# EAGLE design Uno_Shield (EAGLE 8.3.2)
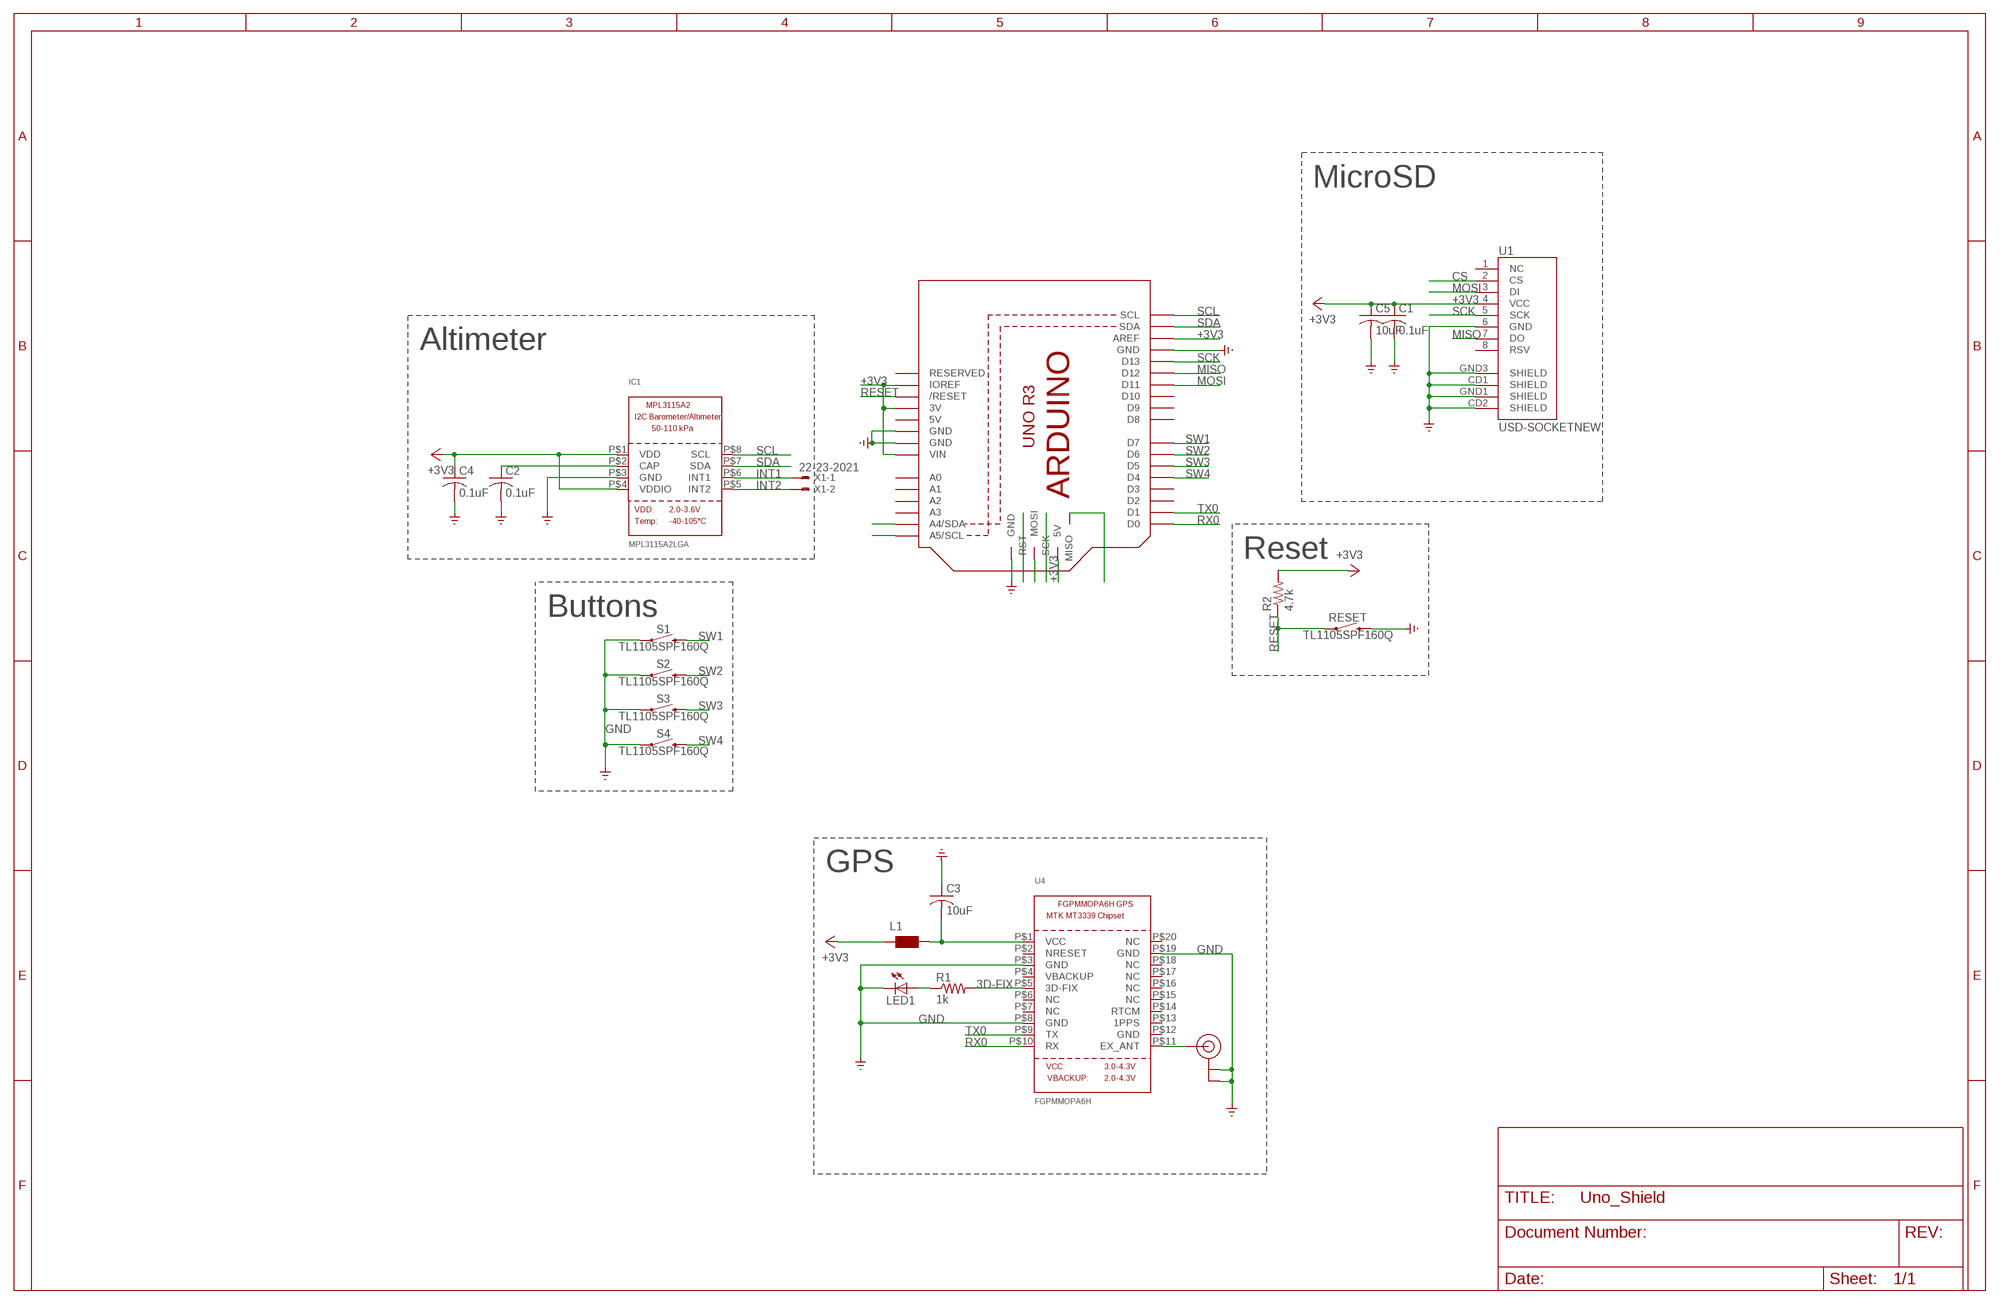
[diagram p0: schematic, sheet 1]

## Parts
C1  0.1uF  C-USC1206  [C1206]
C2  0.1uF  C-USC1206  [C1206]
C3  10uF  C-USC1206  [C1206]
C4  0.1uF  C-USC1206  [C1206]
C5  10uF  C-USC1206  [C1206]
IC1  MPL3115A2LGA  [LGA8]
L1  WE-CBF_1206  [1206]
LED1  LEDSMT1206  [1206]
M1  ARDUINO_R3_ICSP  [ARDUINOR3_ICSP]
R1  1k  R-US_R1206  [R1206]
R2  4.7k  R-US_R1206  [R1206]
RESET  TL1105SPF160Q  MOMENTARY-SWITCH-SPST-PTH-6.0MM  [TACTILE_SWITCH_PTH_6.0MM]
S1  TL1105SPF160Q  MOMENTARY-SWITCH-SPST-PTH-6.0MM  [TACTILE_SWITCH_PTH_6.0MM]
S2  TL1105SPF160Q  MOMENTARY-SWITCH-SPST-PTH-6.0MM  [TACTILE_SWITCH_PTH_6.0MM]
S3  TL1105SPF160Q  MOMENTARY-SWITCH-SPST-PTH-6.0MM  [TACTILE_SWITCH_PTH_6.0MM]
S4  TL1105SPF160Q  MOMENTARY-SWITCH-SPST-PTH-6.0MM  [TACTILE_SWITCH_PTH_6.0MM]
U1  USD-SOCKETNEW  [MICRO-SD-SOCKET-PP]
U4  FGPMMOPA6H  GPS_FGPMMOPA6H  [FGPMMOPA6H]
U$20  U.FL  [U.FL]
X1  22-23-2021  [22-23-2021]

## Nets
3D-FIX: R1.2 U4.P$5(3D-FIX)
3D-FIX_R: LED1.A R1.1
3V3_CLEAN: C3.2 L1.2 U4.P$1(VCC)
+3V3: C1.1 C4.1 C5.1 IC1.P$1(VDD) IC1.P$4(VDDIO) L1.1 M1.3V M1.5V_ICSP(5V) M1.AREF M1.IOREF M1.VIN R2.2 U1.4(VCC)
CAP: C2.1 IC1.P$2(CAP)
CS: U1.2(CS)
EX_ANT: U4.P$11(EX_ANT) U$20.P$3(SIGNAL)
GND: C1.2 C2.2 C3.1 C4.2 C5.2 IC1.P$3(GND) LED1.C M1.GND M1.GND@1(GND) M1.GND@2(GND) M1.GND@3(GND) RESET.3 S1.1 S2.1 S3.1 S4.1 U1.6(GND) U1.CD1(SHIELD) U1.CD2(SHIELD) U1.GND1(SHIELD) U1.GND3(SHIELD) U4.P$3(GND) U4.P$8(GND) U4.P$19(GND) U$20.P$1(GND) U$20.P$2(GND) ; supply symbol labelled GND_
INT1: IC1.P$6(INT1) X1.1
INT2: IC1.P$5(INT2) X1.2
MISO: M1.D12 M1.MISO U1.7(DO)
MOSI: M1.D11 M1.MOSI U1.3(DI)
RESET: M1.RESET(/RESET) M1.RESET_ICSP(RST) R2.1 RESET.1
RX0: M1.D0 U4.P$10(RX)
SCK: M1.D13 M1.SCK U1.5(SCK)
SCL: IC1.P$8(SCL) M1.A5(A5/SCL) M1.SCL
SDA: IC1.P$7(SDA) M1.A4(A4/SDA) M1.SDA
SW1: M1.D7 S1.3
SW2: M1.D6 S2.3
SW3: M1.D5 S3.3
SW4: M1.D4 S4.3
TX0: M1.D1 U4.P$9(TX)
Unconnected: M1.A0 M1.A1 M1.A2 M1.A3 M1.D2 M1.D3 M1.D8 M1.D9 M1.D10 M1.RESERVED U1.1(NC) U1.8(RSV) U4.P$2(NRESET) U4.P$4(VBACKUP) U4.P$6(NC) U4.P$7(NC) U4.P$12(GND) U4.P$13(1PPS) U4.P$14(RTCM) U4.P$15(NC) U4.P$16(NC) U4.P$17(NC) U4.P$18(NC) U4.P$20(NC)

## Notes on the sheet
- MicroSD
- Altimeter
- Reset
- Buttons
- GPS

## Power pins joined to a net without a drawn wire
5V: M1.5V

## Library data of the parts
C1-C5 = adafruit:C-US: CAPACITOR, American symbol
IC1 = microbuilder:MPL3115A2
L1 = wuerth-elektronik:WE-CBF: SMD EMI Suppression Ferrite Beads - excellent anti-EMI properties - low DCR - impedances till 3000 ohms - rated current up to 6 A
LED1 = adafruit:LED: LED OSRAM: - CHIPLED LG R971, LG N971, LY N971, LG Q971, LY Q971, LO R971, LY R971 LH N974, LH R974 LS Q976, LO Q976, LY Q976 LO Q996 - Hyper CHIPLED LW Q18S LB Q993, LB Q99A, LB R99A - SideLED LS A670, LO A670, LY A670, LG A670, LP A670 LB A673, LV A673, LT A673, LW A673 LH A674 LY A675 LS A676, LA A676, LO A676, LY A676, LW A676 LS A679, LY A679, LG A679 - Hyper Micro SIDELED® LS Y876, LA Y876, LO Y876, LY Y876 LT Y87S - SmartLED LW L88C, LW L88S LB L89C, LB L89S, LG L890 LS L89K, LO L89K, LY L89K LS L896, LA L896, LO L896, LY L896 - TOPLED LS T670, LO T670, LY T670, LG T670, LP T670 LSG T670, LSP T670, LSY T670, LOP T670, LYG T670 LG T671, LOG T671, LSG T671 LB T673, LV T673, LT T673, LW T673 LH T674 LS T676, LA T676, LO T676, LY T676, LB T676, LH T676, LSB T676, LW T676 LB T67C, LV T67C, LT T67C, LS T67K, LO T67K, LY T67K, LW E67C LS E67B, LA E67B, LO E67B, LY E67B, LB E67C, LV E67C, LT E67C LW T67C LS T679, LY T679, LG T679 LS T770, LO T770, LY T770, LG T770, LP T770 LB T773, LV T773, LT T773, LW T773 LH T774 LS E675, LA E675, LY E675, LS T675 LS T776, LA T776, LO T776, LY T776, LB T776 LHGB T686 LT T68C, LB T68C - Hyper Mini TOPLED® LB M676 - Mini TOPLED Santana® LG M470 LS M47K, LO M47K, LY M47K Source: http://www.osram.convergy.de/
M1 = adafruit:ARDUINO_R3_ICSP
R1 R2 = adafruit:R-US_: RESISTOR, American symbol
RESET S1-S4 = SparkFun-Switches:MOMENTARY-SWITCH-SPST: Momentary Switch (Pushbutton) - SPST Normally-open (NO) SPST momentary switches (buttons, pushbuttons). Variants PTH-12MM - 12mm square, through-hole Momentary Pushbutton Switch - 12mm Square <https://www.sparkfun.com/products/9190> (COM-09190) PTH-6.0MM, PTH-6.0MM-KIT - 6.0mm square, through-hole Mini Pushbutton Switch <https://www.sparkfun.com/products/97> (COM-00097) KIT package intended for soldering kit's - only one side of pads' copper is exposed. PTH-RIGHT-ANGLE-KIT - Right-angle, through-hole Right Angle Tactile Button <https://www.sparkfun.com/products/10791> - Used on SparkFun BigTime Watch Kit <https://www.sparkfun.com/products/11734> SMD-12MM - 12mm square, surface-mount Tactile Button - SMD (12mm) <https://www.sparkfun.com/products/12993> (COM-12993) Used on SparkFun PicoBoard <https://www.sparkfun.com/products/11888> SMD-4.5MM - 4.5mm Square Trackball Switch Used on SparkFun Blackberry Trackballer Breakout <https://www.sparkfun.com/products/13169> SMD-4.6MMX2.8MM - 4.60mm x 2.80mm, surface mount Used on SparkFun SAMD21 Mini Breakout <https://www.sparkfun.com/products/13664> SMD-5.2MM, SMD-5.2-REDUNDANT - 5.2mm square, surface-mount Mini Pushbutton Switch - SMD <https://www.sparkfun.com/products/8720> (COM-08720) Used on Arduino Pro Mini <https://www.sparkfun.com/products/11114> REDUNDANT package connects both switch circuits together SMD-6.0X3.5MM - 6.0 x 3.5mm, surface mount Momentary Reset Switch SMD <https://www.sparkfun.com/products/8229> (COM-08229) SMD-6.2MM-TALL - 6.2mm square, surface mount Tactile Button - SMD (6mm) <https://www.sparkfun.com/products/12992> Used on SparkFun Digital Sandbox <https://www.sparkfun.com/products/12651> SMD-RIGHT-ANGLE - Right-angle, surface mount Used on SparkFun Block for Intel® Edison - Arduino <https://www.sparkfun.com/products/13036>; PROD_ID: SWCH-08441; SF_SKU: COM-00097
U1 = SparkFun:USD-SOCKET: microSD Socket Push-push type uSD socket. Schematic element and footprint production proven. Spark Fun Electronics SKU : PRT-00127. tDoc lines correctly indicate media card edge positions when inserting (unlocked, locked, depressed).
U4 = microbuilder:GPS_FGPMMOPA6H: GPS Module - MTK MT3339 Chipset, -165dBm sensitivity, 22 channels, 10Hz, auto-select external antenna options
U$20 = microbuilder:U.FL: U.FL Antenna Connector
X1 = con-molex:22-23-2021: .100" (2.54mm) Center Header - 2 Pin; MF: MOLEX; MPN: 22-23-2021; OC_FARNELL: 1462926; OC_NEWARK: 25C3832

## Board
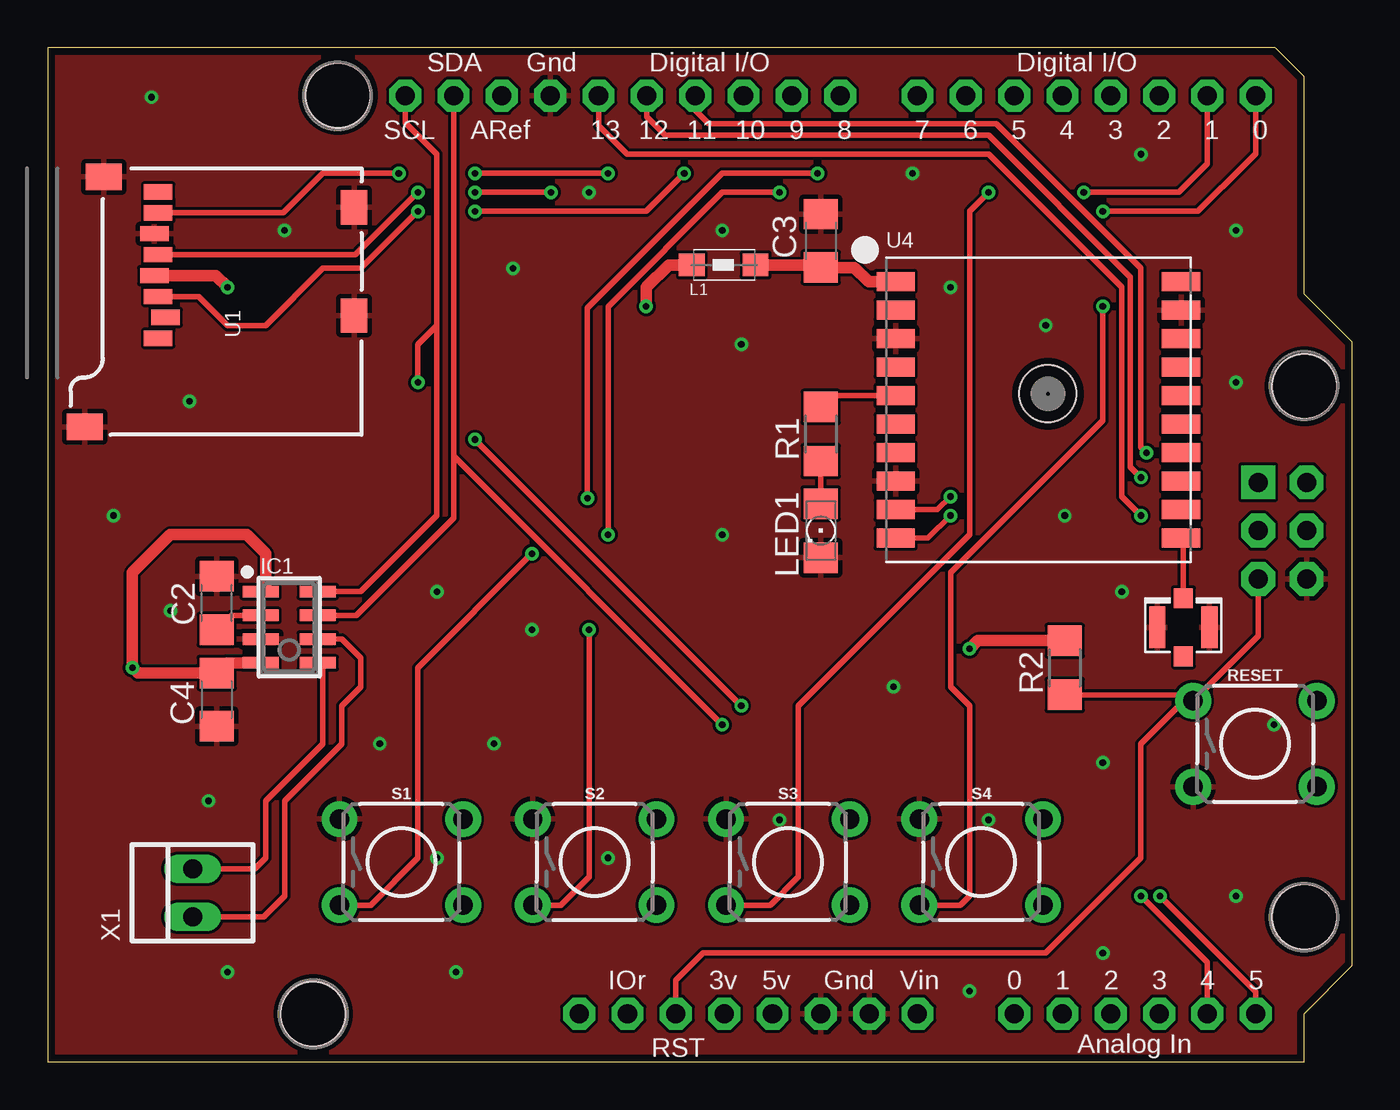
[diagram p1: board, top side]
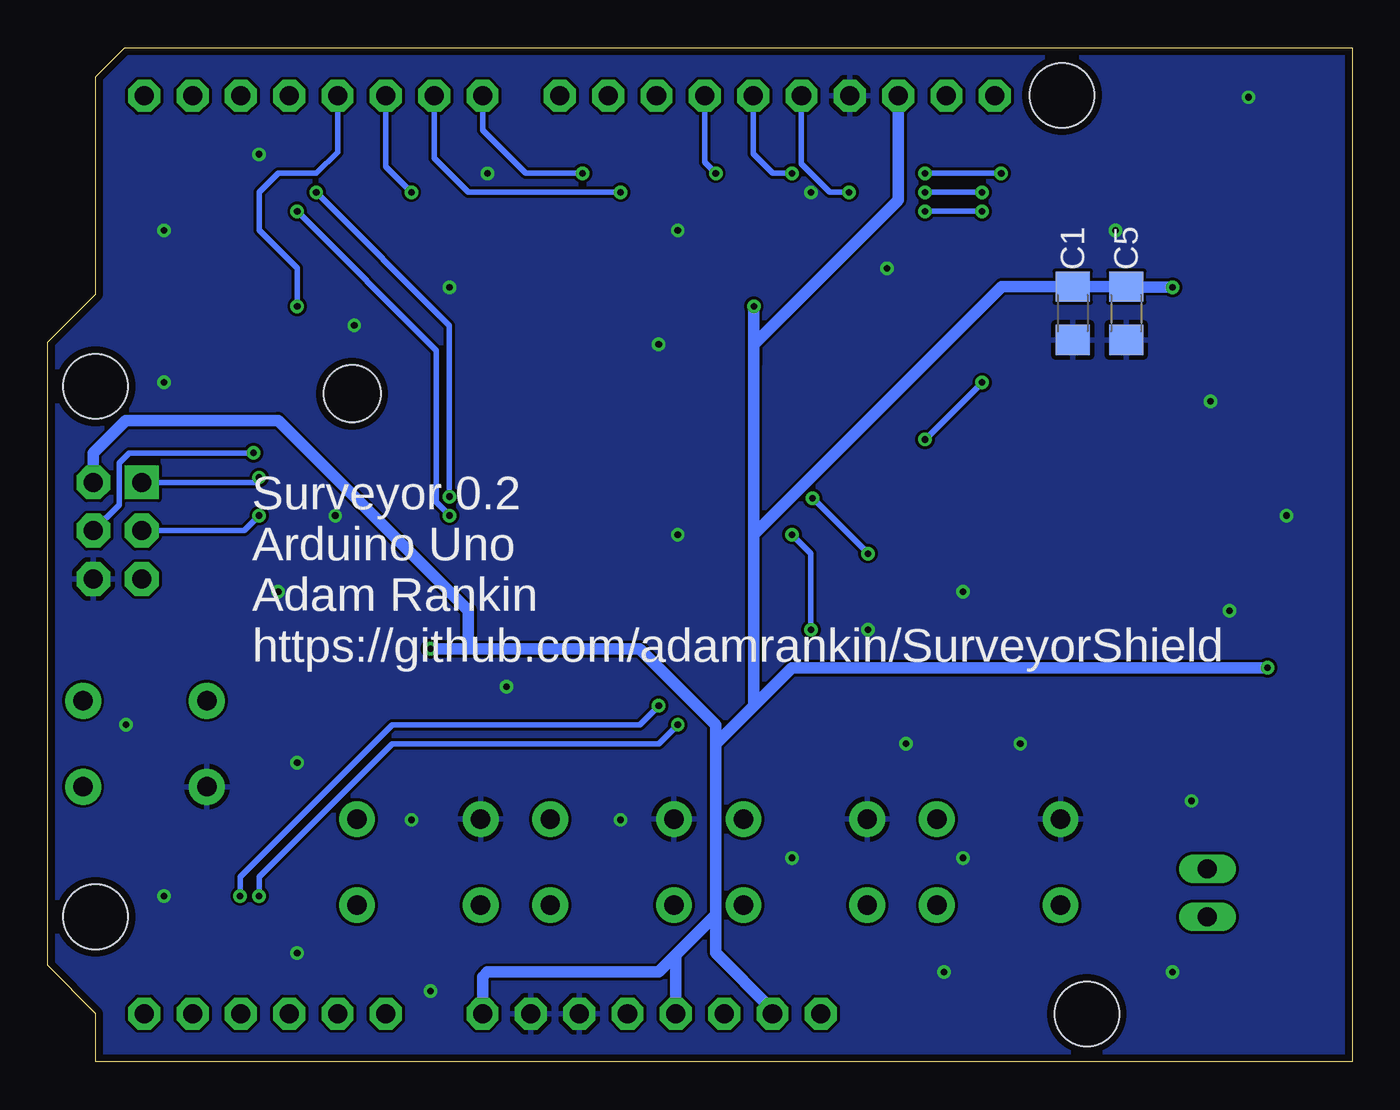
[diagram p2: board, bottom side, seen from below]

Size 68.58 x 53.34 mm. Coordinates in mm from the lower left corner, seen from the top.
Copper layers (1*16): Top 0.0356mm / dielectric 1.5011mm / Bottom 0.0356mm
Design rules "oshpark-2layer": minimum track width 6mil, minimum drill 13mil, track to track 6mil, track to pad 6mil, pad to pad 6mil, via to via 6mil, smd to smd 6mil, copper to edge 15mil, drill to drill 6mil, minimum pad ring 7mil, minimum via ring 7mil, stop-mask expansion 2.5mil, vias tented up to drill 0mil, thermal gap 10mil
Holes 3.4 mm at 15.26,50.83 66.06,35.53 66.06,7.63 13.96,2.53

### Footprints (pad centres in the part's own frame; a part is rotated, then mirrored left to right if it is on the bottom)
C1206 = smd 1.6 x 1.8: 1 -1.4,0; 2 1.4,0
LGA8 = smd 1.9 x 0.6: P$1 -1.5,1.875; P$2 -1.5,0.625; P$3 -1.5,-0.625; P$4 -1.5,-1.875; P$5 1.5,-1.875; P$6 1.5,-0.625; P$7 1.5,0.625; P$8 1.5,1.875
1206 = smd 1.35 x 1.2: 1 -1.7,0; 2 1.65,0
1206' = smd 1.6 x 1.803: A -1.422,0; C 1.422,0
ARDUINOR3_ICSP = drill 1 pad 1.676 octagon: 3V 35.56,2.54; 5V 38.1,2.54; A0 50.8,2.54; A1 53.34,2.54; A2 55.88,2.54; A3 58.42,2.54; A4 60.96,2.54; A5 63.5,2.54; AREF 23.876,50.8; D0 63.5,50.8; D1 60.96,50.8; D2 58.42,50.8; D3 55.88,50.8; D4 53.34,50.8; D5 50.8,50.8; D6 48.26,50.8; D7 45.72,50.8; D8 41.656,50.8; D9 39.116,50.8; D10 36.576,50.8; D11 34.036,50.8; D12 31.496,50.8; D13 28.956,50.8; GND 26.416,50.8; GND@1 43.18,2.54; GND@2 40.64,2.54; IOREF 30.48,2.54; RESERVED 27.94,2.54; RESET 33.02,2.54; SCL 18.796,50.8; SDA 21.336,50.8; VIN 45.72,2.54 | drill 1 pad 1.778 octagon: 5V_ICSP 66.167,30.48; GND@3 66.167,25.4; MOSI 66.167,27.94; RESET_ICSP 63.627,25.4; SCK 63.627,27.94 | drill 1 pad 1.778 square: MISO 63.627,30.48
R1206 = smd 1.6 x 1.803: 1 -1.422,0; 2 1.422,0
TACTILE_SWITCH_PTH_6.0MM = drill 1.016 pad 1.88: 1 -3.251,2.261; 2 3.251,2.261; 3 -3.251,-2.261; 4 3.251,-2.261
MICRO-SD-SOCKET-PP = smd 0.8 x 1.5: 1 -8.94,10.7; 2 -7.84,10.3; 3 -6.74,10.7; 4 -5.64,10.9; 5 -4.54,10.7; 6 -3.44,10.9; 7 -2.34,10.7; 8 -1.24,10.7 | smd 1.8 x 1.4: CD1 -2.05,0.4; CD2 -7.75,0.4 | smd 1.4 x 1.9: GND1 -13.6,14.55; GND3 -0.45,13.55
FGPMMOPA6H = smd 2 x 1: P$1 -7.5,6.75; P$2 -7.5,5.25; P$3 -7.5,3.75; P$4 -7.5,2.25; P$5 -7.5,0.75; P$6 -7.5,-0.75; P$7 -7.5,-2.25; P$8 -7.5,-3.75; P$9 -7.5,-5.25; P$10 -7.5,-6.75; P$11 7.5,-6.75; P$12 7.5,-5.25; P$13 7.5,-3.75; P$14 7.5,-2.25; P$15 7.5,-0.75; P$16 7.5,0.75; P$17 7.5,2.25; P$18 7.5,3.75; P$19 7.5,5.25; P$20 7.5,6.75 | hole 3: 0.5,0.85
U.FL = smd 2.2 x 0.85: P$1 0,1.375; P$2 0,-1.375 | smd 1.05 x 1: P$3 1.525,0; P$4 -1.525,0
22-23-2021 = drill 1 long: 1 -1.27,0; 2 1.27,0

### Placement (x,y rotation side)
C1  14.7,39.37 270 bottom
C2  8.89,24.13 90 top
C3  40.64,43.18 270 top
C4  8.89,19.05 270 top
C5  11.89,39.37 270 bottom
IC1  12.7,22.86 0 top
L1  35.56,41.91 0 top
LED1  [1206']  40.64,27.94 270 top
M1  0,0 0 top
R1  40.64,33.02 90 top
R2  53.46,20.73 90 top
RESET  63.46,16.73 0 top
S1  18.59,10.51 0 top
S2  28.75,10.51 0 top
S3  38.91,10.51 0 top
S4  49.07,10.51 0 top
U1  16.51,46.99 90 top
U4  52.07,34.29 0 top
U$20  59.69,22.86 90 top
X1  7.62,8.89 90 top

### Tracks (layer width: path | path; a pad name or v marks a point on that pad's centre or on a via)
3D-FIX
  Top 0.3: U4.P$5 41.24,35.04 R1.2
3D-FIX_R
  Top 0.3: R1.1 LED1.A
3V3_CLEAN
  Top 0.6: L1.2 40.51,41.91 C3.2 42.41,41.78 43.15,41.04 U4.P$1
+3V3  (via drill 0.35)
  Top 0.6: U1.4 8.84,41.35 v9.46,40.73 | L1.1 32.64,41.91 31.46,40.73 v31.46,39.73 | R2.2 48.88,22.15 v48.46,21.73 | IC1.P$4 9.43,20.98 C4.1 4.74,20.45 v4.46,20.73 4.46,25.73 6.46,27.73 10.46,27.73 11.46,26.73 11.46,25 IC1.P$1
  Bottom 0.6: v9.46,40.73 11.85,40.73 C5.1 C1.1 18.42,40.77 31.46,27.73 | 35.56,5.63 M1.3V | 35.56,5.63 33.46,7.73 | v4.46,20.73 29.46,20.73 31.46,18.73 | 31.46,27.73 31.46,37.73 | M1.VIN 45.72,4.47 45.46,4.73 36.46,4.73 35.56,5.63 | M1.IOREF 30.48,2.75 33.46,5.73 33.46,7.73 | 33.46,7.73 33.46,16.73 | 33.46,16.73 31.46,18.73 | 31.46,18.73 31.46,27.73 | 33.46,16.73 33.46,17.73 37.46,21.73 v48.46,21.73 46.46,21.73 46.46,23.73 56.46,33.73 64.46,33.73 66.17,32.02 M1.5V_ICSP | 31.46,37.73 31.46,36.73 | M1.AREF 23.88,45.31 31.46,37.73 | 31.46,37.73 v31.46,39.73
CAP
  Top 0.3: IC1.P$2 9.64,23.48 C2.1
EX_ANT
  Top 0.3: U$20.P$3 59.69,27.42
  Top 0.6: 59.69,27.42 U4.P$11
GND  (via drill 0.35)
  other vias: 5.46,50.73 7.46,34.73 12.46,43.73 24.46,41.73 28.46,45.73 35.46,43.73 36.46,37.73 25.46,22.73 20.46,24.73 23.46,16.73 17.46,16.73 8.46,13.73 6.46,23.73 3.46,28.73 9.46,4.73 21.46,4.73 48.46,3.73 49.46,12.73 38.46,12.73 29.46,10.73 20.46,10.73 44.46,19.73 55.46,15.73 56.46,24.73 53.46,28.73 52.46,38.73 47.46,40.73 45.46,46.73 57.46,47.73 62.46,43.73 62.46,35.73 64.46,17.73 62.46,8.73 55.46,5.73 35.46,27.73
  pour Top: -1.54,53.73 69.46,53.73 72.46,50.73 72.46,3.73 65.46,-3.27 -1.54,-3.27 -5.54,0.73 -5.54,49.73
  pour Bottom: -6.54,49.73 -1.54,54.73 69.46,54.73 73.46,50.73 73.46,3.73 65.46,-4.27 -1.54,-4.27 -6.54,0.73
INT1
  Top 0.3: IC1.P$6 15.46,22.23 16.46,21.23 16.46,19.73 15.46,18.73 15.46,16.73 12.46,13.73 12.46,8.73 11.35,7.62 X1.1
INT2
  Top 0.3: X1.2 10.89,10.16 11.46,10.73 11.46,13.73 14.46,16.73 14.46,20.73 IC1.P$5
MISO  (via drill 0.35)
  Top 0.3: M1.D12 31.5,49.69 32.46,48.73 49.46,48.73 56.91,41.28 56.91,40.73 | v57.46,30.73 56.91,31.28 56.91,40.73 | 56.91,40.92 56.91,40.73 | U1.7 12.38,44.65 14.46,46.73 v18.46,46.73 | v22.46,46.73 v29.46,46.73
  Bottom 0.3: M1.MISO 57.71,30.48 v57.46,30.73 | v18.46,46.73 v22.46,46.73 | v29.46,46.73 30.46,46.73 31.5,47.77 M1.D12
MOSI  (via drill 0.35)
  Top 0.3: M1.D11 34.04,50.05 34.76,49.33 49.86,49.33 57.46,41.73 57.46,32.33 v57.76,32.03 | U1.3 7.94,40.25 9.46,38.73 11.46,38.73 14.46,41.73 16.46,41.73 v19.46,44.73 | v22.46,44.73 31.46,44.73 v33.46,46.73
  Bottom 0.3: M1.MOSI 64.82,29.29 64.82,31.49 64.28,32.03 v57.76,32.03 | v19.46,44.73 v22.46,44.73 | M1.D11 34.04,47.31 v33.46,46.73
RESET
  Top 0.3: M1.RESET_ICSP 63.63,22.41 RESET.1 | R2.1 59.89,19.31 RESET.1 | RESET.1 59.72,18.99 57.46,16.73 57.46,10.73 52.46,5.73 34.46,5.73 33.02,4.29 M1.RESET
  Top 0.6: 53.78,18.99 R2.1
RX0  (via drill 0.35)
  Top 0.3: U4.P$10 46.27,27.54 v47.46,28.73 | v55.46,44.73 60.46,44.73 62.96,47.23 | 62.96,47.23 63.46,47.73 | M1.D0 63.5,47.77 62.96,47.23
  Bottom 0.3: v47.46,28.73 47.46,28.77 48.14,29.45 48.14,37.41 v55.46,44.73
SCK  (via drill 0.35)
  Top 0.3: M1.D13 28.96,49.23 30.46,47.73 49.46,47.73 56.46,40.73 56.46,29.73 v57.46,28.73 | U1.5 16.18,42.45 v19.46,45.73 | v22.46,45.73 v26.46,45.73
  Bottom 0.3: M1.SCK 58.25,27.94 v57.46,28.73 | v19.46,45.73 v22.46,45.73 | v26.46,45.73 27.46,45.73 28.96,47.23 M1.D13
SCL  (via drill 0.35)
  Top 0.3: IC1.P$8 16.46,24.73 20.46,28.73 20.46,38.73 | 20.46,38.73 20.46,47.73 18.8,49.39 M1.SCL | M1.A5 63.5,3.69 v58.46,8.73 | v36.46,18.73 v22.46,32.73 | v19.46,35.73 19.46,37.73 20.46,38.73
  Bottom 0.3: v58.46,8.73 58.46,9.73 50.46,17.73 37.46,17.73 v36.46,18.73 | v22.46,32.73 v19.46,35.73
SDA  (via drill 0.35)
  Top 0.3: M1.A4 60.96,5.23 v57.46,8.73 | 21.34,31.85 v35.46,17.73 | M1.SDA 21.34,31.85 | IC1.P$7 16.21,23.48 21.34,28.61 21.34,31.85
  Bottom 0.3: v57.46,8.73 57.46,9.73 50.46,16.73 36.46,16.73 v35.46,17.73
SW1  (via drill 0.35)
  Top 0.3: S1.3 16.98,8.25 19.46,10.73 19.46,20.73 v25.46,26.73 | v28.37,29.64 28.37,39.64 35.46,46.73 v40.46,46.73
  Bottom 0.3: v25.46,26.73 v28.37,29.64 | v40.46,46.73 43.46,46.73 45.72,48.99 M1.D7
SW2  (via drill 0.35)
  Top 0.3: S2.3 26.98,8.25 28.46,9.73 v28.46,22.73 | v29.46,27.73 29.46,39.73 35.46,45.73 v38.46,45.73
  Bottom 0.3: v28.46,22.73 28.46,26.73 v29.46,27.73 | v38.46,45.73 46.46,45.73 48.26,47.53 M1.D6
SW3  (via drill 0.35)
  Top 0.3: S3.3 37.98,8.25 39.46,9.73 39.46,18.73 48.46,27.73 48.46,44.73 v49.46,45.73
  Bottom 0.3: M1.D5 50.8,47.07 v49.46,45.73
SW4  (via drill 0.35)
  Top 0.3: S4.3 47.98,8.25 48.46,8.73 48.46,18.73 47.46,19.73 47.46,25.73 55.46,33.73 v55.46,39.73
  Bottom 0.3: M1.D4 53.34,47.85 54.46,46.73 56.46,46.73 57.46,45.73 57.46,43.73 55.46,41.73 v55.46,39.73
TX0  (via drill 0.35)
  Top 0.3: U4.P$9 46.77,29.04 v47.46,29.73 | v54.46,45.73 59.46,45.73 60.96,47.23 M1.D1
  Bottom 0.3: v47.46,29.73 47.46,38.73 v54.46,45.73

### Text on the board
bPlace: Surveyor 0.2 / Arduino Uno / Adam Rankin / https://github.com/adamrankin/SurveyorShield